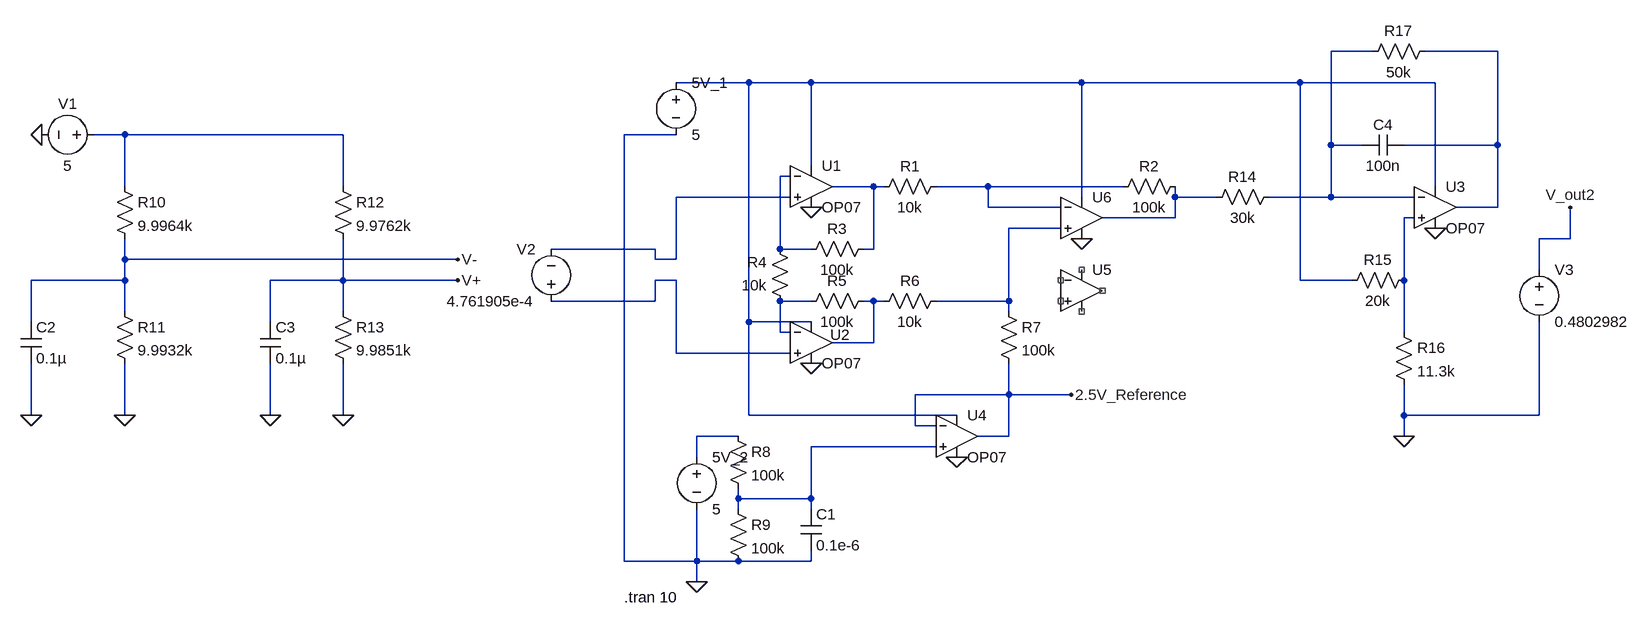
[diagram p0: schematic 4_instrumentation_amplifier.asc]
4_instrumentation_amplifier.asc, the LTspice schematic file:
Version 4.1
SHEET 1 1352 864
WIRE 944 -128 880 -128
WIRE 1136 -128 1024 -128
WIRE -16 -80 -128 -80
WIRE 80 -80 -16 -80
WIRE 496 -80 80 -80
WIRE 832 -80 496 -80
WIRE 1040 -80 832 -80
WIRE -976 0 -1024 0
WIRE -640 0 -976 0
WIRE -128 0 -208 0
WIRE 880 16 880 -128
WIRE 928 16 880 16
WIRE 1136 16 1136 -128
WIRE 1136 16 992 16
WIRE 80 48 80 -80
WIRE 48 64 32 64
WIRE -976 80 -976 0
WIRE -640 80 -640 0
WIRE 176 80 112 80
WIRE 192 80 176 80
WIRE 352 80 272 80
WIRE 560 80 352 80
WIRE 1040 80 1040 -80
WIRE 48 96 -128 96
WIRE 496 96 496 -80
WIRE 640 96 640 80
WIRE 704 96 640 96
WIRE 880 96 880 16
WIRE 880 96 784 96
WIRE 1008 96 880 96
WIRE 352 112 352 80
WIRE 464 112 352 112
WIRE 1136 112 1136 16
WIRE 1136 112 1072 112
WIRE 640 128 640 96
WIRE 640 128 528 128
WIRE 1008 128 992 128
WIRE 464 144 384 144
WIRE 1248 160 1248 112
WIRE 1248 160 1200 160
WIRE -160 176 -320 176
WIRE 32 176 32 64
WIRE 80 176 32 176
WIRE 176 176 176 80
WIRE 176 176 160 176
WIRE -976 192 -976 160
WIRE -464 192 -976 192
WIRE -160 192 -160 176
WIRE -128 192 -128 96
WIRE -128 192 -160 192
WIRE 1200 208 1200 160
WIRE -976 224 -976 192
WIRE -976 224 -1120 224
WIRE -640 224 -640 160
WIRE -640 224 -752 224
WIRE -464 224 -640 224
WIRE -128 224 -160 224
WIRE 832 224 832 -80
WIRE 912 224 832 224
WIRE 992 224 992 128
WIRE -160 256 -160 224
WIRE -160 256 -320 256
WIRE 80 256 32 256
WIRE 176 256 160 256
WIRE 192 256 176 256
WIRE 384 256 384 144
WIRE 384 256 272 256
WIRE -976 272 -976 224
WIRE -640 272 -640 224
WIRE 384 272 384 256
WIRE -1120 288 -1120 224
WIRE -752 288 -752 224
WIRE -16 288 -16 -80
WIRE 80 288 -16 288
WIRE 32 304 32 256
WIRE 48 304 32 304
WIRE 992 304 992 224
WIRE 176 320 176 256
WIRE 176 320 112 320
WIRE -128 336 -128 224
WIRE 48 336 -128 336
WIRE 384 400 384 352
WIRE 384 400 240 400
WIRE 480 400 384 400
WIRE -1120 432 -1120 352
WIRE -976 432 -976 352
WIRE -752 432 -752 352
WIRE -640 432 -640 352
WIRE -16 432 -16 288
WIRE 304 432 -16 432
WIRE 992 432 992 384
WIRE 1200 432 1200 288
WIRE 1200 432 992 432
WIRE 240 448 240 400
WIRE 272 448 240 448
WIRE -32 464 -96 464
WIRE 384 464 384 400
WIRE 384 464 336 464
WIRE 992 464 992 432
WIRE 272 480 80 480
WIRE -96 496 -96 464
WIRE -32 560 -32 544
WIRE 80 560 80 480
WIRE 80 560 -32 560
WIRE -32 576 -32 560
WIRE 80 576 80 560
WIRE -208 656 -208 0
WIRE -96 656 -96 576
WIRE -96 656 -208 656
WIRE -32 656 -96 656
WIRE 80 656 80 640
WIRE 80 656 -32 656
WIRE -96 688 -96 656
FLAG -96 688 0
FLAG 80 112 0
FLAG 80 352 0
FLAG 496 160 0
FLAG 304 496 0
FLAG 480 400 2.5V_Reference
FLAG -1120 432 0
FLAG -976 432 0
FLAG -752 432 0
FLAG -640 432 0
FLAG -1104 0 0
FLAG -464 224 V+
FLAG -464 192 V-
FLAG 1040 144 0
FLAG 1248 112 V_out2
FLAG 992 464 0
SYMBOL OpAmps\\OP07 80 16 R0
SYMATTR InstName U1
SYMBOL OpAmps\\OP07 80 256 R0
WINDOW 0 29 52 Left 2
SYMATTR InstName U2
SYMBOL OpAmps\\OP07 304 400 R0
SYMATTR InstName U4
SYMBOL res 288 64 R90
WINDOW 0 0 56 VBottom 2
WINDOW 3 32 56 VTop 2
SYMATTR InstName R1
SYMATTR Value 10k
SYMBOL res 656 64 R90
WINDOW 0 0 56 VBottom 2
WINDOW 3 32 56 VTop 2
SYMATTR InstName R2
SYMATTR Value 100k
SYMBOL res 176 160 R90
WINDOW 0 0 56 VBottom 2
WINDOW 3 32 56 VTop 2
SYMATTR InstName R3
SYMATTR Value 100k
SYMBOL res 48 272 R180
WINDOW 0 36 76 Left 2
WINDOW 3 36 40 Left 2
SYMATTR InstName R4
SYMATTR Value 10k
SYMBOL res 64 272 R270
WINDOW 0 32 56 VTop 2
WINDOW 3 0 56 VBottom 2
SYMATTR InstName R5
SYMATTR Value 100k
SYMBOL res 176 272 R270
WINDOW 0 32 56 VTop 2
WINDOW 3 0 56 VBottom 2
SYMATTR InstName R6
SYMATTR Value 10k
SYMBOL res 368 256 R0
SYMATTR InstName R7
SYMATTR Value 100k
SYMBOL res -48 448 R0
SYMATTR InstName R8
SYMATTR Value 100k
SYMBOL res -48 560 R0
SYMATTR InstName R9
SYMATTR Value 100k
SYMBOL cap 64 576 R0
SYMATTR InstName C1
SYMATTR Value 0.1e-6
SYMBOL voltage -96 480 R0
WINDOW 123 0 0 Left 0
WINDOW 39 0 0 Left 0
SYMATTR InstName 5V_2
SYMATTR Value 5
SYMBOL voltage -128 -96 R0
WINDOW 123 0 0 Left 0
WINDOW 39 0 0 Left 0
SYMATTR InstName 5V_1
SYMATTR Value 5
SYMBOL OpAmps\\UniversalOpAmp 496 240 R0
SYMATTR InstName U5
SYMBOL OpAmps\\UniversalOpAmp2 496 128 R0
SYMATTR InstName U6
SYMBOL voltage -1008 0 R90
WINDOW 0 -32 56 VBottom 2
WINDOW 3 32 56 VTop 2
WINDOW 123 0 0 Left 0
WINDOW 39 0 0 Left 0
SYMATTR InstName V1
SYMATTR Value 5
SYMBOL res -992 64 R0
SYMATTR InstName R10
SYMATTR Value 9.9964k
SYMBOL res -992 256 R0
SYMATTR InstName R11
SYMATTR Value 9.9932k
SYMBOL cap -1136 288 R0
SYMATTR InstName C2
SYMATTR Value 0.1µ
SYMBOL res -656 64 R0
SYMATTR InstName R12
SYMATTR Value 9.9762k
SYMBOL res -656 256 R0
SYMATTR InstName R13
SYMATTR Value 9.9851k
SYMBOL cap -768 288 R0
SYMATTR InstName C3
SYMATTR Value 0.1µ
SYMBOL OpAmps\\OP07 1040 48 R0
SYMATTR InstName U3
SYMBOL res 1008 208 R90
WINDOW 0 0 56 VBottom 2
WINDOW 3 32 56 VTop 2
SYMATTR InstName R15
SYMATTR Value 20k
SYMBOL cap 992 0 R90
WINDOW 0 0 32 VBottom 2
WINDOW 3 32 32 VTop 2
SYMATTR InstName C4
SYMATTR Value 100n
SYMBOL res 976 288 R0
SYMATTR InstName R16
SYMATTR Value 11.3k
SYMBOL res 1040 -144 R90
WINDOW 0 0 56 VBottom 2
WINDOW 3 32 56 VTop 2
SYMATTR InstName R17
SYMATTR Value 50k
SYMBOL voltage -320 272 R180
WINDOW 0 24 96 Left 2
WINDOW 3 24 16 Left 2
WINDOW 123 0 0 Left 0
WINDOW 39 0 0 Left 0
SYMATTR InstName V2
SYMATTR Value 4.761905e-4
SYMBOL res 800 80 R90
WINDOW 0 0 56 VBottom 2
WINDOW 3 32 56 VTop 2
SYMATTR InstName R14
SYMATTR Value 30k
SYMBOL voltage 1200 192 R0
WINDOW 123 0 0 Left 0
WINDOW 39 0 0 Left 0
SYMATTR InstName V3
SYMATTR Value 0.4802982
TEXT -208 712 Left 2 !.tran 10

The netlist it stands for:
* 4_instrumentation_amplifier.asc
X§U1 N008 N005 N003 0 N006 LT1001  ; OP07, pins In+ In- V+ V- OUT
X§U2 N012 N013 N003 0 N014 LT1001  ; OP07, pins In+ In- V+ V- OUT
X§U4 N016 2.5V_Reference N003 0 2.5V_Reference LT1001  ; OP07, pins In+ In- V+ V- OUT
R1 N007 N006 10k
R2 N009 N007 100k
R3 N006 N005 100k
R4 N013 N005 10k
R5 N013 N014 100k
R6 N014 N011 10k
R7 N011 2.5V_Reference 100k
R8 N015 N016 100k
R9 N016 0 100k
C1 N016 0 0.1e-6
V§5V_2 N015 0 5
V§5V_1 N003 0 5
X§U5 NC_01 NC_02 NC_03 NC_04 NC_05 level1 Avol=1Meg GBW=10Meg Vos=0 En=0 Enk=0 In=0 Ink=0 Rin=500Meg  ; pins In+ In- V+ V- OUT
X§U6 N011 N007 N003 0 N009 level2 Avol=1Meg GBW=10Meg Slew=10Meg Ilimit=25m Rail=0 Vos=0 En=0 Enk=0 In=0 Ink=0 Rin=500Meg  ; pins In+ In- V+ V- OUT
V1 N004 0 5
R10 N004 V- 9.9964k
R11 V- 0 9.9932k
C2 V- 0 0.1µ
R12 N004 V+ 9.9762k
R13 V+ 0 9.9851k
C3 V+ 0 0.1µ
X§U3 N010 N001 N003 0 N002 LT1001  ; OP07, pins In+ In- V+ V- OUT
R15 N010 N003 20k
C4 N002 N001 100n
R16 N010 0 11.3k
R17 N002 N001 50k
V2 N012 N008 4.761905e-4
R14 N001 N009 30k
V3 V_out2 0 0.4802982
.tran 10
.lib LTC.lib
.lib UniversalOpAmp1.lib
.lib UniversalOpAmp2.lib
.backanno
.end